# Altium schematic sheet 05_CIS.SchDoc
size OrCAD B
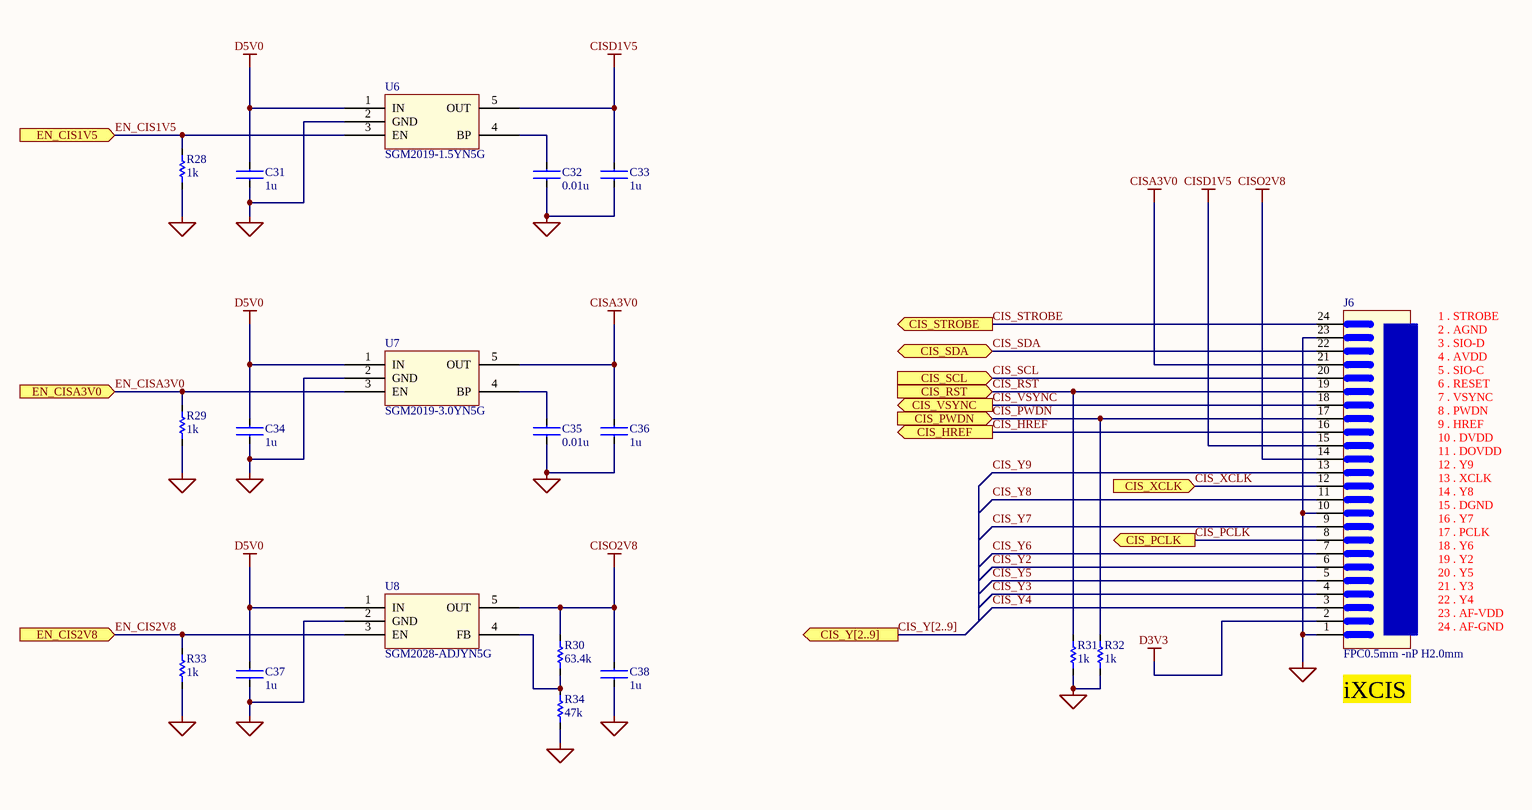
[diagram p0: 05_CIS.SchDoc]

## Parts
C31  1u  [CAPC1608X09N_C0603]
C32  0.01u  [C0402]
C33  1u  [CAPC1608X09N_C0603]
C34  1u  [CAPC1608X09N_C0603]
C35  0.01u  [C0402]
C36  1u  [CAPC1608X09N_C0603]
C37  1u  [CAPC1608X09N_C0603]
C38  1u  [CAPC1608X09N_C0603]
J6  FPC0.5mm -nP H2.0mm  [FPC0.5mm-nPH2.0mm]
R28  1k  [R0402]
R29  1k  [R0402]
R30  63.4k  [R0402]
R31  1k  [R0402]
R32  1k  [R0402]
R33  1k  [R0402]
R34  47k  [R0402]
U6  SGM2019-1.5YN5G  [SOT95P280X125-5N_SGM2019]
U7  SGM2019-3.0YN5G  [SOT95P280X125-5N_SGM2019]
U8  SGM2028-ADJYN5G  [SOT95P280X125-5N_SGM2028]

## Ports
CIS_HREF (out), CIS_PCLK (out), CIS_PWDN (in), CIS_RST (in), CIS_SCL (in), CIS_SDA (bidir), CIS_STROBE (out), CIS_VSYNC (out), CIS_XCLK (in), CIS_Y[2..9] (out), EN_CIS1V5 (in), EN_CIS2V8 (in), EN_CISA3V0 (in)

## Nets
CISA3V0: C36.1 J6.21 U7.5(OUT)
CISD1V5: C33.1 J6.15 U6.5(OUT)
CISO2V8: C38.1 J6.14 R30.2 U8.5(OUT)
D3V3: J6.2
D5V0: C31.1 C34.1 C37.1 U6.1(IN) U7.1(IN) U8.1(IN)
GND: C31.2 C32.2 C33.2 C34.2 C35.2 C36.2 C37.2 C38.2 J6.1 J6.10 J6.23 R28.1 R29.1 R31.1 R32.1 R33.1 R34.1 U6.2(GND) U7.2(GND) U8.2(GND)
CIS_HREF: J6.16 ; port CIS_HREF
CIS_PCLK: J6.8 ; port CIS_PCLK
CIS_PWDN: J6.17 R32.2 ; port CIS_PWDN
CIS_RST: J6.19 R31.2 ; port CIS_RST
CIS_SCL: J6.20 ; port CIS_SCL
CIS_SDA: J6.22 ; port CIS_SDA
CIS_STROBE: J6.24 ; port CIS_STROBE
CIS_VSYNC: J6.18 ; port CIS_VSYNC
CIS_XCLK: J6.12 ; port CIS_XCLK
CIS_Y2: J6.6
CIS_Y3: J6.4
CIS_Y4: J6.3
CIS_Y5: J6.5
CIS_Y6: J6.7
CIS_Y7: J6.9
CIS_Y8: J6.11
CIS_Y9: J6.13
EN_CIS1V5: R28.2 U6.3(EN) ; port EN_CIS1V5
EN_CIS2V8: R33.2 U8.3(EN) ; port EN_CIS2V8
EN_CISA3V0: R29.2 U7.3(EN) ; port EN_CISA3V0
NetC32_1: C32.1 U6.4(BP)
NetC35_1: C35.1 U7.4(BP)
NetR30_1: R30.1 R34.2 U8.4(FB)

## Buses and harness runs
bus CIS_Y[2..9] = port CIS_Y[2..9]

## Notes on the sheet
- 1 . STROBE
- 2 . AGND
- 3 . SIO-D
- 4 . AVDD
- 5 . SIO-C
- 6 . RESET
- 7 . VSYNC
- 8 . PWDN
- 9 . HREF
- 10 . DVDD
- 11 . DOVDD
- 12 . Y9
- 13 . XCLK
- 14 . Y8
- 15 . DGND
- 16 . Y7
- 17 . PCLK
- 18 . Y6
- 19 . Y2
- 20 . Y5
- 21 . Y3
- 22 . Y4
- 23 . AF-VDD
- 24 . AF-GND
- (near J6) iXCIS

## Library data of the parts
C31 C33 C34 C36-C38 = CAP12: CAP,Ceramic,X7R,10%,16V,1uF,0603; Manufacturer1: *; Manufacturer2: *; PartNumberManufacturer1: *; UnitPrice: *; Value: 1u
C32 C35 = CAP0112: CAP,Ceramic,X7R,10%,16V,0.01uF,0402; Manufacturer1: *; Manufacturer2: *; PartNumberManufacturer1: *; UnitPrice: *; Value: 0.01u
J6 = FPC0.5mm_02: FFC socket,24-Pin,bottom contact,0.5mm Pitch,SMD; Manufacturer1: TBD; Manufacturer2: *; PartNumberManufacturer1: FPC0.5mm -nP H2.0mm; PartNumberManufacturer2: *; UnitPrice: *
R28 R29 R31-R33 = RES011: RES,1k,1%,1/16W,0402; PartNumberManufacturer2: *; Manufacturer2: *; PartNumberManufacturer1: *; UnitPrice: *; Manufacturer1: *; Value: 1k
R30 = RES0126: RES,63.4k,1%,1/16W,0402; Manufacturer1: *; PartNumberManufacturer2: *; Manufacturer2: *; PartNumberManufacturer1: *; Value: 63.4k; UnitPrice: *
R34 = RES0127: RES,47k,1%,1/16W,0402; Manufacturer1: *; PartNumberManufacturer2: *; Manufacturer2: *; PartNumberManufacturer1: *; Value: 47k; UnitPrice: *
U6 = SGM2019-1.5: IC,LDO 1.5V@300mA,SOT23-5; Manufacturer1: SGM; PartNumberManufacturer1: SGM2019-1.5YN5G; Manufacturer2: *; PartNumberManufacturer2: *; UnitPrice: *
U7 = SGM2019-3.0: IC,LDO 3.0V@300mA,SOT23-5; Manufacturer1: SGM; PartNumberManufacturer1: SGM2019-3.0YN5G; Manufacturer2: *; PartNumberManufacturer2: *; UnitPrice: *
U8 = SGM2028-ADJ: IC,LDO 500mA,Adjustable,SOT23-5; Manufacturer1: SGM; PartNumberManufacturer1: SGM2028-ADJYN5G; Manufacturer2: *; PartNumberManufacturer2: *; UnitPrice: *